# EAGLE design Camera shield v1 (EAGLE 6.1)
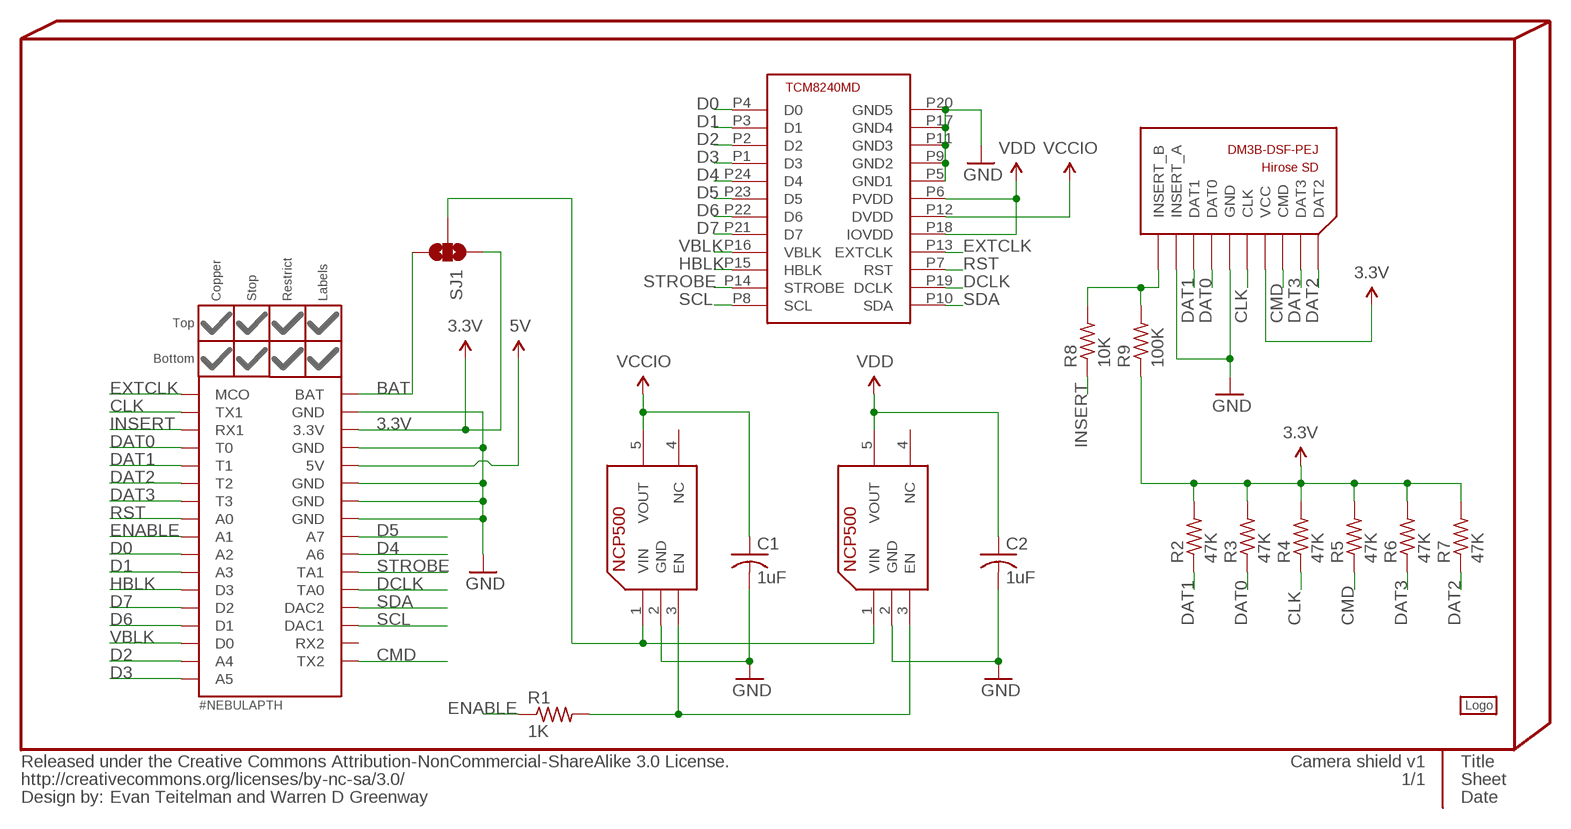
[diagram p0: schematic, sheet 1]

## Parts
C1  1uF  C-USC0402  [C0402]
C2  1uF  C-USC0402  [C0402]
INFO2  Evan Teitelman and Warren D Greenway  %CC-NC-SA  [%CC-NC-SA]
LOGO1  #PYGMYLOGONORMAL  #PYGMYLOGOLARGE  [#PYGMYLOGO]
NEBULA1  #NEBULAPTH  [#NEBULA-PTH]
R1  1K  R-US_R0402  [R0402]
R2  47K  R-US_R0402  [R0402]
R3  47K  R-US_R0402  [R0402]
R4  47K  R-US_R0402  [R0402]
R5  47K  R-US_R0402  [R0402]
R6  47K  R-US_R0402  [R0402]
R7  47K  R-US_R0402  [R0402]
R8  10K  R-US_R0402  [R0402]
R9  100K  R-US_R0402  [R0402]
SJ1  SOLDERJUMPER_2WAYS  [SJ_3]
U$2  TCM8240MD  [TCM8240MD]
U$3  NCP500  [SOT23-5L]
U$4  NCP500  [SOT23-5L]
U$5  HIROSE-SDCARD-DM3B-DSF-PEJ  [HIROSE-SDCARD-DM3B-DSF-PEJ]

## Nets
3.3V: NEBULA1.3.3V R2.2 R3.2 R4.2 R5.2 R6.2 R7.2 R9.1 SJ1.1 U$5.P$4(VCC) ; supply symbol labelled @3.3V
5V: NEBULA1.5V ; supply symbol labelled @5V
BAT: NEBULA1.BAT SJ1.3
CLK: NEBULA1.COM1_TX(TX1) R4.1 U$5.P$5(CLK)
CMD: NEBULA1.COM2_TX(TX2) R5.1 U$5.P$3(CMD)
D0: NEBULA1.A2 U$2.P4(D0)
D1: NEBULA1.A3 U$2.P3(D1)
D2: NEBULA1.A4 U$2.P2(D2)
D3: NEBULA1.A5 U$2.P1(D3)
D4: NEBULA1.A6 U$2.P24(D4)
D5: NEBULA1.A7 U$2.P23(D5)
D6: NEBULA1.D1 U$2.P22(D6)
D7: NEBULA1.D2 U$2.P21(D7)
DAT0: NEBULA1.T0 R3.1 U$5.P$7(DAT0)
DAT1: NEBULA1.T1 R2.1 U$5.P$8(DAT1)
DAT2: NEBULA1.T2 R7.1 U$5.P$1(DAT2)
DAT3: NEBULA1.T3 R6.1 U$5.P$2(DAT3)
DCLK: NEBULA1.TA0 U$2.P19(DCLK)
ENABLE: NEBULA1.A1 R1.1
EXTCLK: NEBULA1.MCO U$2.P13(EXTCLK)
GND: C1.2 C2.2 NEBULA1.GND1(GND) NEBULA1.GND2(GND) NEBULA1.GND3(GND) NEBULA1.GND4(GND) NEBULA1.GND5(GND) U$2.P5(GND1) U$2.P9(GND2) U$2.P11(GND3) U$2.P17(GND4) U$2.P20(GND5) U$3.2(GND) U$4.2(GND) U$5.P$6(GND) U$5.P$9(INSERT_A) ; supply symbol labelled @GND
HBLK: NEBULA1.D3 U$2.P15(HBLK)
INSERT: NEBULA1.COM1_RX(RX1) R8.1
N$1: R1.2 U$3.3(EN) U$4.3(EN)
N$2: SJ1.2 U$3.1(VIN) U$4.1(VIN)
N$9: R8.2 R9.2 U$5.P$11(INSERT_B)
RST: NEBULA1.A0 U$2.P7(RST)
SCL: NEBULA1.DAC1 U$2.P8(SCL)
SDA: NEBULA1.DAC2 U$2.P10(SDA)
STROBE: NEBULA1.TA1 U$2.P14(STROBE)
VBLK: NEBULA1.D0 U$2.P16(VBLK)
VCCIO: C1.1 U$2.P12(DVDD) U$3.5(VOUT) ; supply symbol labelled @VCCIO
VDD: C2.1 U$2.P6(PVDD) U$2.P18(IOVDD) U$4.5(VOUT) ; supply symbol labelled @VDD
Unconnected: NEBULA1.COM2_RX(RX2) U$3.4(NC) U$4.4(NC)

## Power pins joined to a net without a drawn wire
GND: U$5.P$12(GND) U$5.P$13(GND) U$5.P$14(GND)

## Library data of the parts
C1 C2 = rcl:C-US: CAPACITOR, American symbol
INFO2 = PygmyBoards:%CC-NC-SA: Released under the Creative Commons Attribution-NonCommercial-ShareAlike 3.0 License. http://creativecommons.org/licenses/by-sa/3.0 Design by: [Designer Name] Change this part's value to change the designer name
LOGO1 = Pygmy:#PYGMYLOGO
NEBULA1 = PygmyBoards:#NEBULA: Nebula Board and Shield Footprint Pads This is the only absolutely required part for the footprint. The parts in "#NEBULA-PART" are merely aesthetic. A circular board outline should be .001" thick and 1.005" in diameter (Reference circle on the Document (48) layer provided).
R1-R9 = rcl:R-US_: RESISTOR, American symbol
SJ1 = Pygmy:SOLDERJUMPER_2WAY: Solder Jumper 2 way solder jumper
U$2 = Pygmy:TCM8240MD
U$3 U$4 = Pygmy:NCP500
U$5 = Pygmy:HIROSE-SDCARD-DM3B-DSF-PEJ

## Board
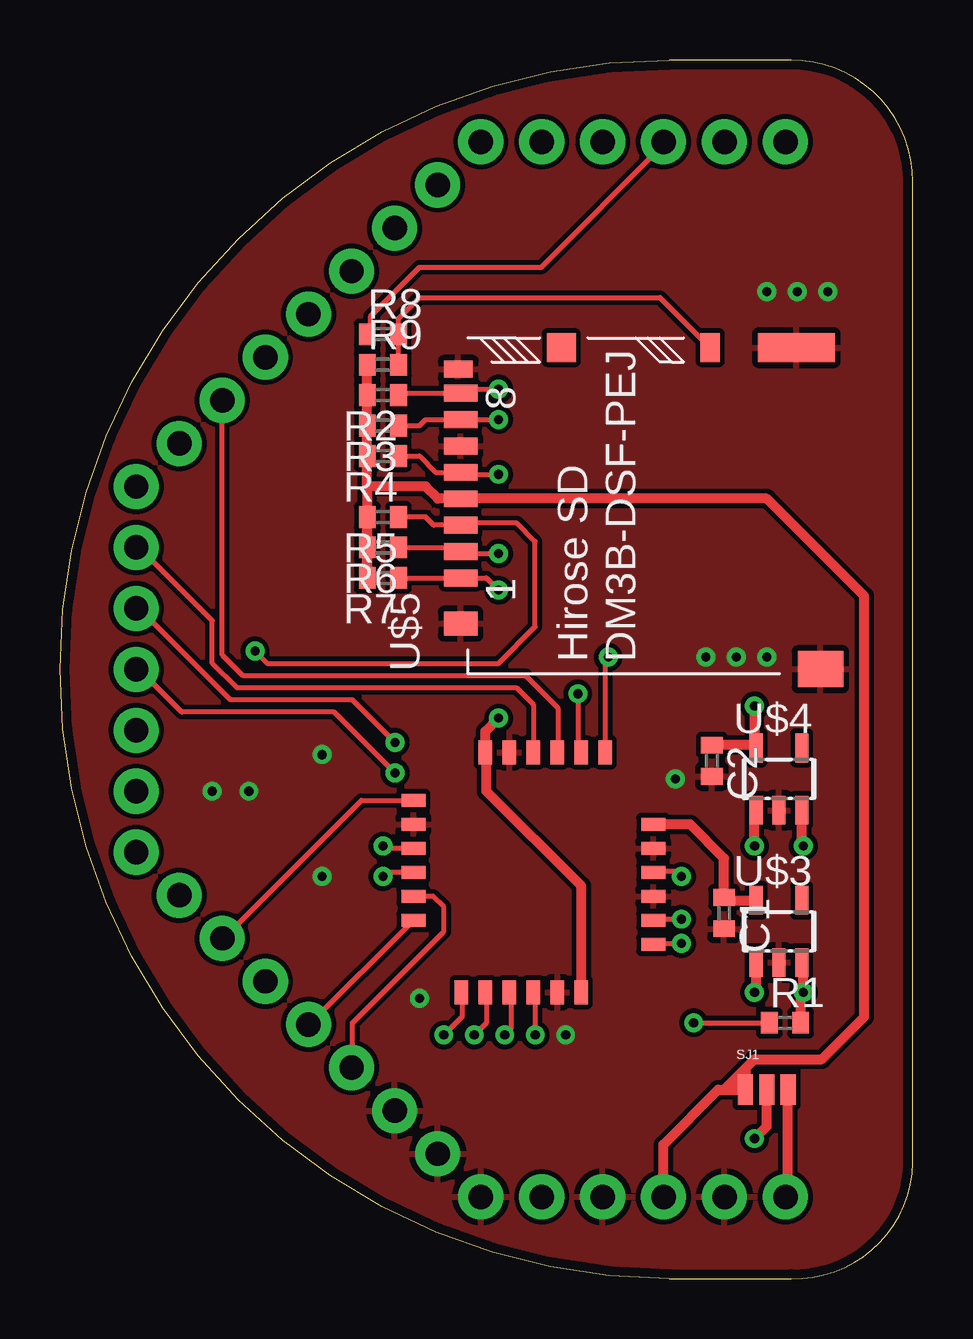
[diagram p1: board, top side]
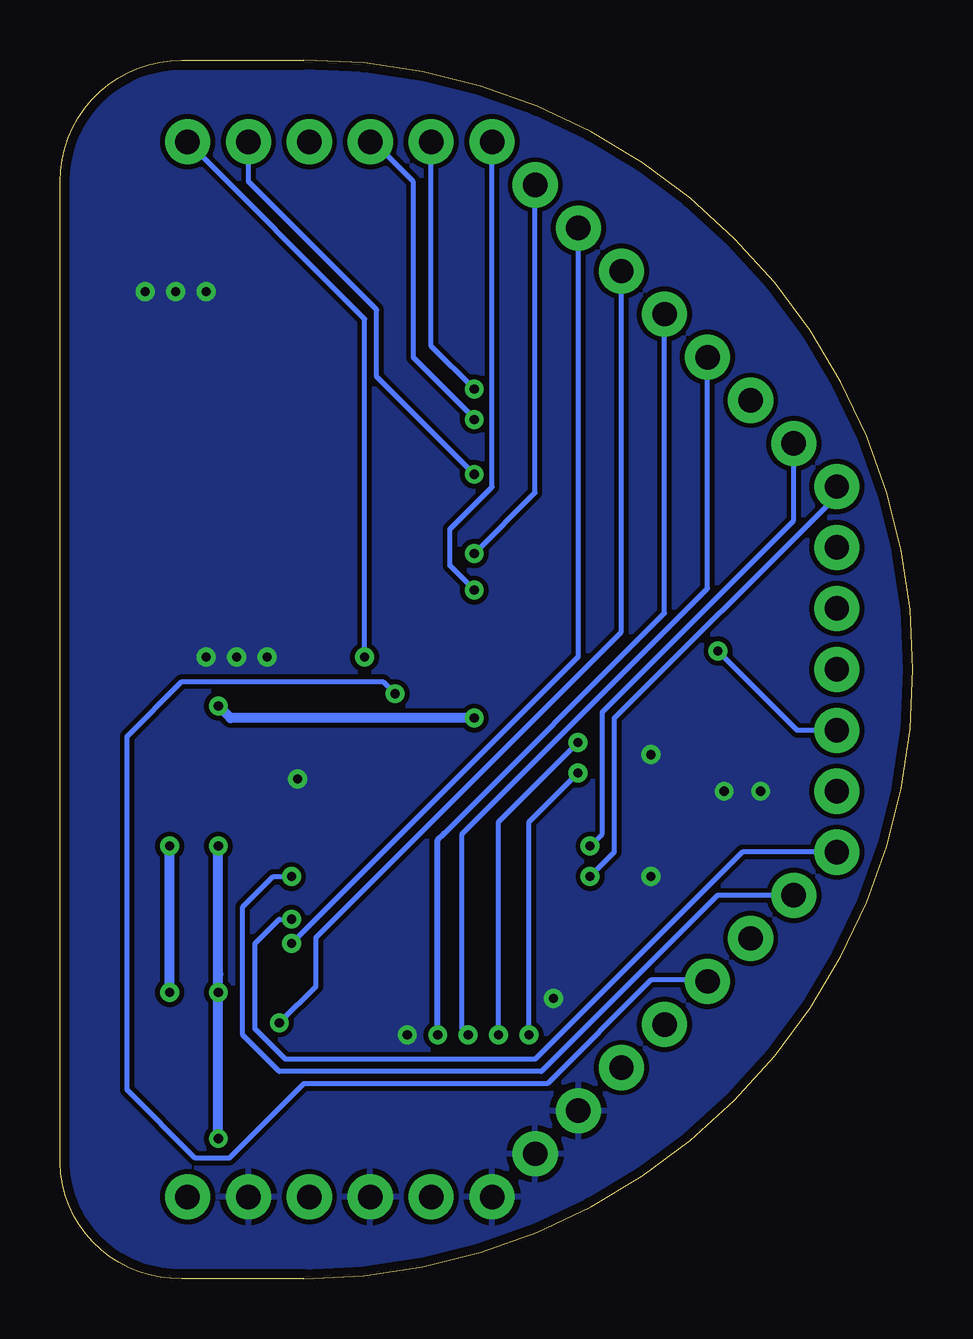
[diagram p2: board, bottom side, seen from below]

Size 35.56 x 50.8 mm. Coordinates in mm from the lower left corner, seen from the top.
Outline: 25.4,0 arc-180 25.4,50.8 30.48,50.8 arc-90 35.56,45.72 35.56,4.83 arc-90 30.48,0 25.4,0
Copper layers (1*16): Top 0.035mm / dielectric 1.5mm / Bottom 0.035mm
Design rules: minimum track width 6mil, minimum drill 15mil, track to track 6mil, track to pad 6mil, pad to pad 4mil, via to via 6mil, smd to smd 4mil, copper to edge 15mil, drill to drill 6mil, minimum pad ring 10mil, minimum via ring 8mil, stop-mask expansion 4mil, vias tented up to drill 25mil, thermal gap 10mil

### Footprints (pad centres in the part's own frame; a part is rotated, then mirrored left to right if it is on the bottom)
C0402 = smd 0.7 x 0.9: 1 -0.65,0; 2 0.65,0
#NEBULA-PTH@1 = drill 1.016 pad 1.88: 3.3V -25.637,-47.388; 5V -30.716,-47.388; A0 -36.848,-7.004; A1 -38.645,-8.8; A2 -40.44,-10.596; A3 -42.237,-12.392; A4 -47.625,-22.86; A5 -47.625,-25.4; A6 -40.44,-40.204; A7 -38.645,-42; BAT -20.557,-47.388; COM1_RX -25.636,-3.412; COM1_TX -23.096,-3.412; COM2_RX -47.625,-30.48; COM2_TX -47.625,-27.94; D0 -47.625,-20.32; D1 -47.625,-17.78; D2 -45.829,-15.984; D3 -44.032,-14.188; DAC1 -47.625,-33.02; DAC2 -45.829,-34.816; GND1 -36.848,-43.796; GND2 -35.052,-45.592; GND3 -33.256,-47.388; GND4 -28.177,-47.388; GND5 -23.097,-47.388; MCO -20.556,-3.412; T0 -28.176,-3.412; T1 -30.716,-3.412; T2 -33.256,-3.412; T3 -35.052,-5.208; TA0 -44.032,-36.612; TA1 -42.237,-38.408
R0402 = smd 0.7 x 0.9: 1 -0.65,0; 2 0.65,0
SJ_3 = smd 0.635 x 1.27: 1 -0.889,0; 2 0,0; 3 0.889,0
TCM8240MD = smd 0.55 x 1: P1 2,0; P2 3,0; P3 4,0; P4 5,0; P5 6,0; P6 7,0; P13 8,10; P14 7,10; P15 6,10; P16 5,10; P17 4,10; P18 3,10 | smd 1 x 0.55: P7 10,2; P8 10,3; P9 10,4; P10 10,5; P11 10,6; P12 10,7; P19 0,8; P20 0,7; P21 0,6; P22 0,5; P23 0,4; P24 0,3
SOT23-5L = smd 0.55 x 1.2: 1 -0.95,-1.3; 2 0,-1.3; 3 0.95,-1.3; 4 0.95,1.3; 5 -0.95,1.3
HIROSE-SDCARD-DM3B-DSF-PEJ = smd 0.7 x 1.4: P$1 0,-0.7; P$2 1.1,-0.7; P$3 2.2,-0.7; P$4 3.3,-0.7; P$5 4.4,-0.7; P$6 5.5,-0.7; P$7 6.6,-0.7; P$8 7.7,-0.7 | smd 0.7 x 1.2: P$9 8.7,-0.6 | smd 1.2 x 1.2: P$10 9.6,-4.9 | smd 1.2 x 0.8: P$11 9.6,-11.1 | smd 1.2 x 3.2: P$12 9.6,-14.7 | smd 1.5 x 1.9: P$13 -3.8,-15.7 | smd 1 x 1.4: P$14 -1.9,-0.7

### Placement (x,y rotation side)
C1  27.69,15.24 270 top
C2  27.18,21.59 270 top
INFO2  -2.54,-10.16 0 top  (outside the outline)
LOGO1  27.43,17.02 0 bottom
NEBULA1  #NEBULAPTH  [#NEBULA-PTH@1]  50.8,50.8 0 top
R1  30.23,10.67 0 top
R2  13.46,36.83 180 top
R3  13.46,35.56 180 top
R4  13.46,34.29 180 top
R5  13.46,31.75 180 top
R6  13.46,30.48 180 top
R7  13.46,29.21 180 top
R8  13.46,39.37 0 top
R9  13.46,38.1 0 top
SJ1  29.46,7.87 0 top
U$2  14.73,11.94 0 top
U$3  29.97,14.48 0 top
U$4  29.97,20.83 0 top
U$5  16,29.21 90 top

### Tracks (layer width: path | path; a pad name or v marks a point on that pad's centre or on a via)
3.3V
  Top 0.406: 27.69,7.87 27.43,7.87 25.15,5.59 25.15,3.43 NEBULA1.3.3V | 27.69,7.87 28.19,7.87 | 28.19,7.87 SJ1.1 28.57,8.76 | 28.57,8.76 28.96,9.14 31.75,9.14 33.53,10.92 33.53,28.45 29.46,32.51 U$5.P$4 15.75,32.51 15.24,33.02 12.81,33.02 | R6.2 R5.2 R7.2 12.81,33.02 | 12.81,33.02 R4.2 R3.2 R2.2 R9.1 | 27.69,7.87 28.57,8.76 | 28.19,7.87 28.45,8.13
BAT
  Top 0.406: SJ1.3 30.35,3.52 NEBULA1.BAT
CLK  (via drill 0.38)
  Top 0.203: R4.1 14.99,34.29 15.67,33.61 U$5.P$5 16.78,33.53 v18.29,33.53
  Bottom 0.203: v18.29,33.53 22.35,37.59 22.35,40.39 27.7,45.74 NEBULA1.COM1_TX
CMD  (via drill 0.38)
  Top 0.203: R5.1 15.24,31.75 15.58,31.41 U$5.P$3 16.79,31.5 19.05,31.5 19.81,30.73 19.81,27.18 18.29,25.65 8.64,25.65 v8.13,26.16
  Bottom 0.203: v8.13,26.16 4.83,22.86 NEBULA1.COM2_TX
D0  (via drill 0.38)
  Top 0.203: v19.81,10.16 19.81,11.86 U$2.P4
  Bottom 0.203: 19.56,18.54 10.36,27.74 NEBULA1.A2
  Bottom 0.254: 19.56,18.54 19.81,18.29 v19.81,10.16
D1  (via drill 0.38)
  Top 0.203: v18.54,10.16 18.8,10.41 18.8,11.87 U$2.P3
  Bottom 0.203: v18.54,10.16 18.8,10.41 18.8,18.54 8.56,28.78 NEBULA1.A3
D2  (via drill 0.38)
  Top 0.203: v13.97,22.35 12.19,24.13 7.11,24.13 3.3,27.94 NEBULA1.A4 | U$2.P2 17.78,11.89 17.78,10.67 v17.27,10.16
  Bottom 0.203: v13.97,22.35 17.27,19.05 v17.27,10.16
D3  (via drill 0.38)
  Top 0.203: v13.97,21.08 11.43,23.62 5.08,23.62 3.3,25.4 NEBULA1.A5 | U$2.P1 16.76,11.91 16.76,10.92 v16,10.16
  Bottom 0.203: v13.97,21.08 16,19.05 v16,10.16
D4
  Top 0.203: U$2.P24 10.39,10.6 NEBULA1.A6
D5
  Top 0.203: U$2.P23 15.56,15.94 16,15.49 16,14.48 12.19,10.67 12.19,8.84 NEBULA1.A7
D6  (via drill 0.38)
  Top 0.203: U$2.P22 13.64,16.94 v13.46,16.76
  Bottom 0.203: v13.46,16.76 12.45,17.78 12.45,23.37 3.56,32.26 3.56,33.02 NEBULA1.D1
D7  (via drill 0.38)
  Top 0.203: U$2.P21 13.56,17.94 v13.46,18.03
  Bottom 0.203: NEBULA1.D2 4.97,31.61 12.95,23.62 12.95,18.54 v13.46,18.03
DAT0  (via drill 0.38)
  Top 0.203: R3.1 14.99,35.56 15.24,35.81 U$5.P$7 v18.29,35.81
  Bottom 0.203: v18.29,35.81 18.29,35.85 20.83,38.39 20.83,45.72 22.5,47.39 NEBULA1.T0
DAT1  (via drill 0.38)
  Top 0.203: R2.1 14.19,36.91 U$5.P$8 16.88,37.08 v18.29,37.08
  Bottom 0.203: v18.29,37.08 20.08,38.88 NEBULA1.T1
DAT2  (via drill 0.38)
  Top 0.203: R7.1 U$5.P$1 17.78,29.21 v18.29,28.7
  Bottom 0.203: v18.29,28.7 19.3,29.72 19.3,31.24 17.54,33 NEBULA1.T2
DAT3  (via drill 0.38)
  Top 0.203: U$5.P$2 16.17,30.31 | v18.29,30.23 16.79,30.23 U$5.P$2 | R6.1 16.53,30.48 U$5.P$2
  Bottom 0.203: v18.29,30.23 15.75,32.77 NEBULA1.T3
DCLK
  Top 0.203: U$2.P19 12.57,19.94 6.86,14.22 6.8,14.22 NEBULA1.TA0
ENABLE  (via drill 0.38)
  Top 0.203: v26.42,10.67 R1.1
  Bottom 0.203: v26.42,10.67 24.89,12.19 24.89,14.22 12.16,26.96 NEBULA1.A1
EXTCLK  (via drill 0.38)
  Top 0.203: U$2.P13 22.73,25.78 v22.86,25.91
  Bottom 0.203: v22.86,25.91 22.86,40.01 NEBULA1.MCO
GND  (via drill 0.38)
  other vias: 29.46,41.15 30.73,41.15 32,41.15 25.65,20.83 29.46,25.91 28.19,25.91 26.92,25.91 10.92,21.84 10.92,16.76 7.87,20.32 6.35,20.32 14.99,11.68 21.08,10.16
  pour Bottom (isolate 0.203): -2.54,-2.54 38.1,-2.54 38.1,53.34 -2.54,53.34
  pour Top (isolate 0.203): -1.27,-1.27 36.83,-1.27 36.83,52.07 -1.27,52.07
HBLK
  Top 0.203: U$2.P15 20.75,21.96 20.75,23.8 19.41,25.15 7.62,25.15 6.77,26 NEBULA1.D3
INSERT
  Top 0.203: R8.1 12.95,39.51 12.95,40.13 14.99,42.16 20.07,42.16 25.16,47.26 NEBULA1.COM1_RX
N$1  (via drill 0.38)
  Top 0.406: U$4.3 30.92,18.1 v30.99,18.03 | U$3.3 30.99,13.11 v30.99,11.94 30.88,11.83 R1.2
  Bottom 0.406: v30.99,11.94 v30.99,18.03
N$2  (via drill 0.38)
  Top 0.406: SJ1.2 29.46,6.35 v28.96,5.84 | v28.96,18.03 28.96,19.46 U$4.1 | U$3.1 29.02,12 v28.96,11.94
  Bottom 0.406: v28.96,5.84 v28.96,11.94 28.96,12.7 v28.96,18.03
N$9
  Top 0.203: 27.1,38.94 U$5.P$11 25.02,40.89 14.99,40.89 14.11,40.02 R8.2 R9.2
RST  (via drill 0.38)
  Top 0.203: U$2.P7 24.76,13.97 v25.91,13.97
  Bottom 0.203: v25.91,13.97 13.95,25.93 NEBULA1.A0
SCL  (via drill 0.38)
  Top 0.203: v25.91,14.99 24.78,14.99 U$2.P8
  Bottom 0.203: NEBULA1.DAC1 7.11,17.78 15.75,9.14 26.16,9.14 27.43,10.41 27.43,13.97 26.42,14.99 v25.91,14.99
SDA  (via drill 0.38)
  Top 0.203: U$2.P10 24.76,16.97 25.71,16.97 v25.91,16.76
  Bottom 0.203: NEBULA1.DAC2 8.15,15.98 15.49,8.64 26.42,8.64 27.94,10.16 27.94,15.49 26.67,16.76 v25.91,16.76
STROBE  (via drill 0.38)
  Top 0.203: v21.59,24.38 21.59,22.08 U$2.P14
  Bottom 0.203: v21.59,24.38 22.1,24.89 30.48,24.89 32.77,22.61 32.77,7.87 29.92,5.03 28.5,5.03 25.4,8.13 15.24,8.13 10.92,12.45 8.62,12.45 NEBULA1.TA1
VBLK
  Top 0.203: U$2.P16 19.74,23.93 19.03,24.64 7.37,24.64 6.35,25.65 6.35,27.43 3.3,30.48 NEBULA1.D0
VCCIO
  Top 0.406: U$2.P12 26.27,18.94 27.69,17.53 C1.1 27.8,15.78 U$3.5
VDD  (via drill 0.38)
  Top 0.406: U$4.5 28.91,22.24 | v18.29,23.37 17.73,22.81 U$2.P18 17.78,21.89 17.78,20.32 21.73,16.37 U$2.P6 | v28.96,23.88 28.96,22.19 U$4.5 | C2.1 29.07,22.24 29.02,22.19 U$4.5
  Bottom 0.406: v18.29,23.37 28.45,23.37 v28.96,23.88

### Text on the board
bTest: Pygmy Camera 1.3M Shield | Version 1 | Designed By: | Evan Teitelman | Warren D Greenway
Document: Pygmy Camera 1.3M Shield | Version 1.0 | Standard Grid: 50mil | Routing Grids: 8mil / 4mil